# EasyEDA Pro project DA_CNNC.eprj

# Schematic Schematic1
Board Name: 3Pha; Create Date: 2026-03-05; Page Name: P1; Project Name: DA_CNNC; Schematic Name: Schematic1; Update Date: 2026-04-14; Company: EasyEDA.com; Drawn: NV Trieu; Page Size: A4; Version: V1.0
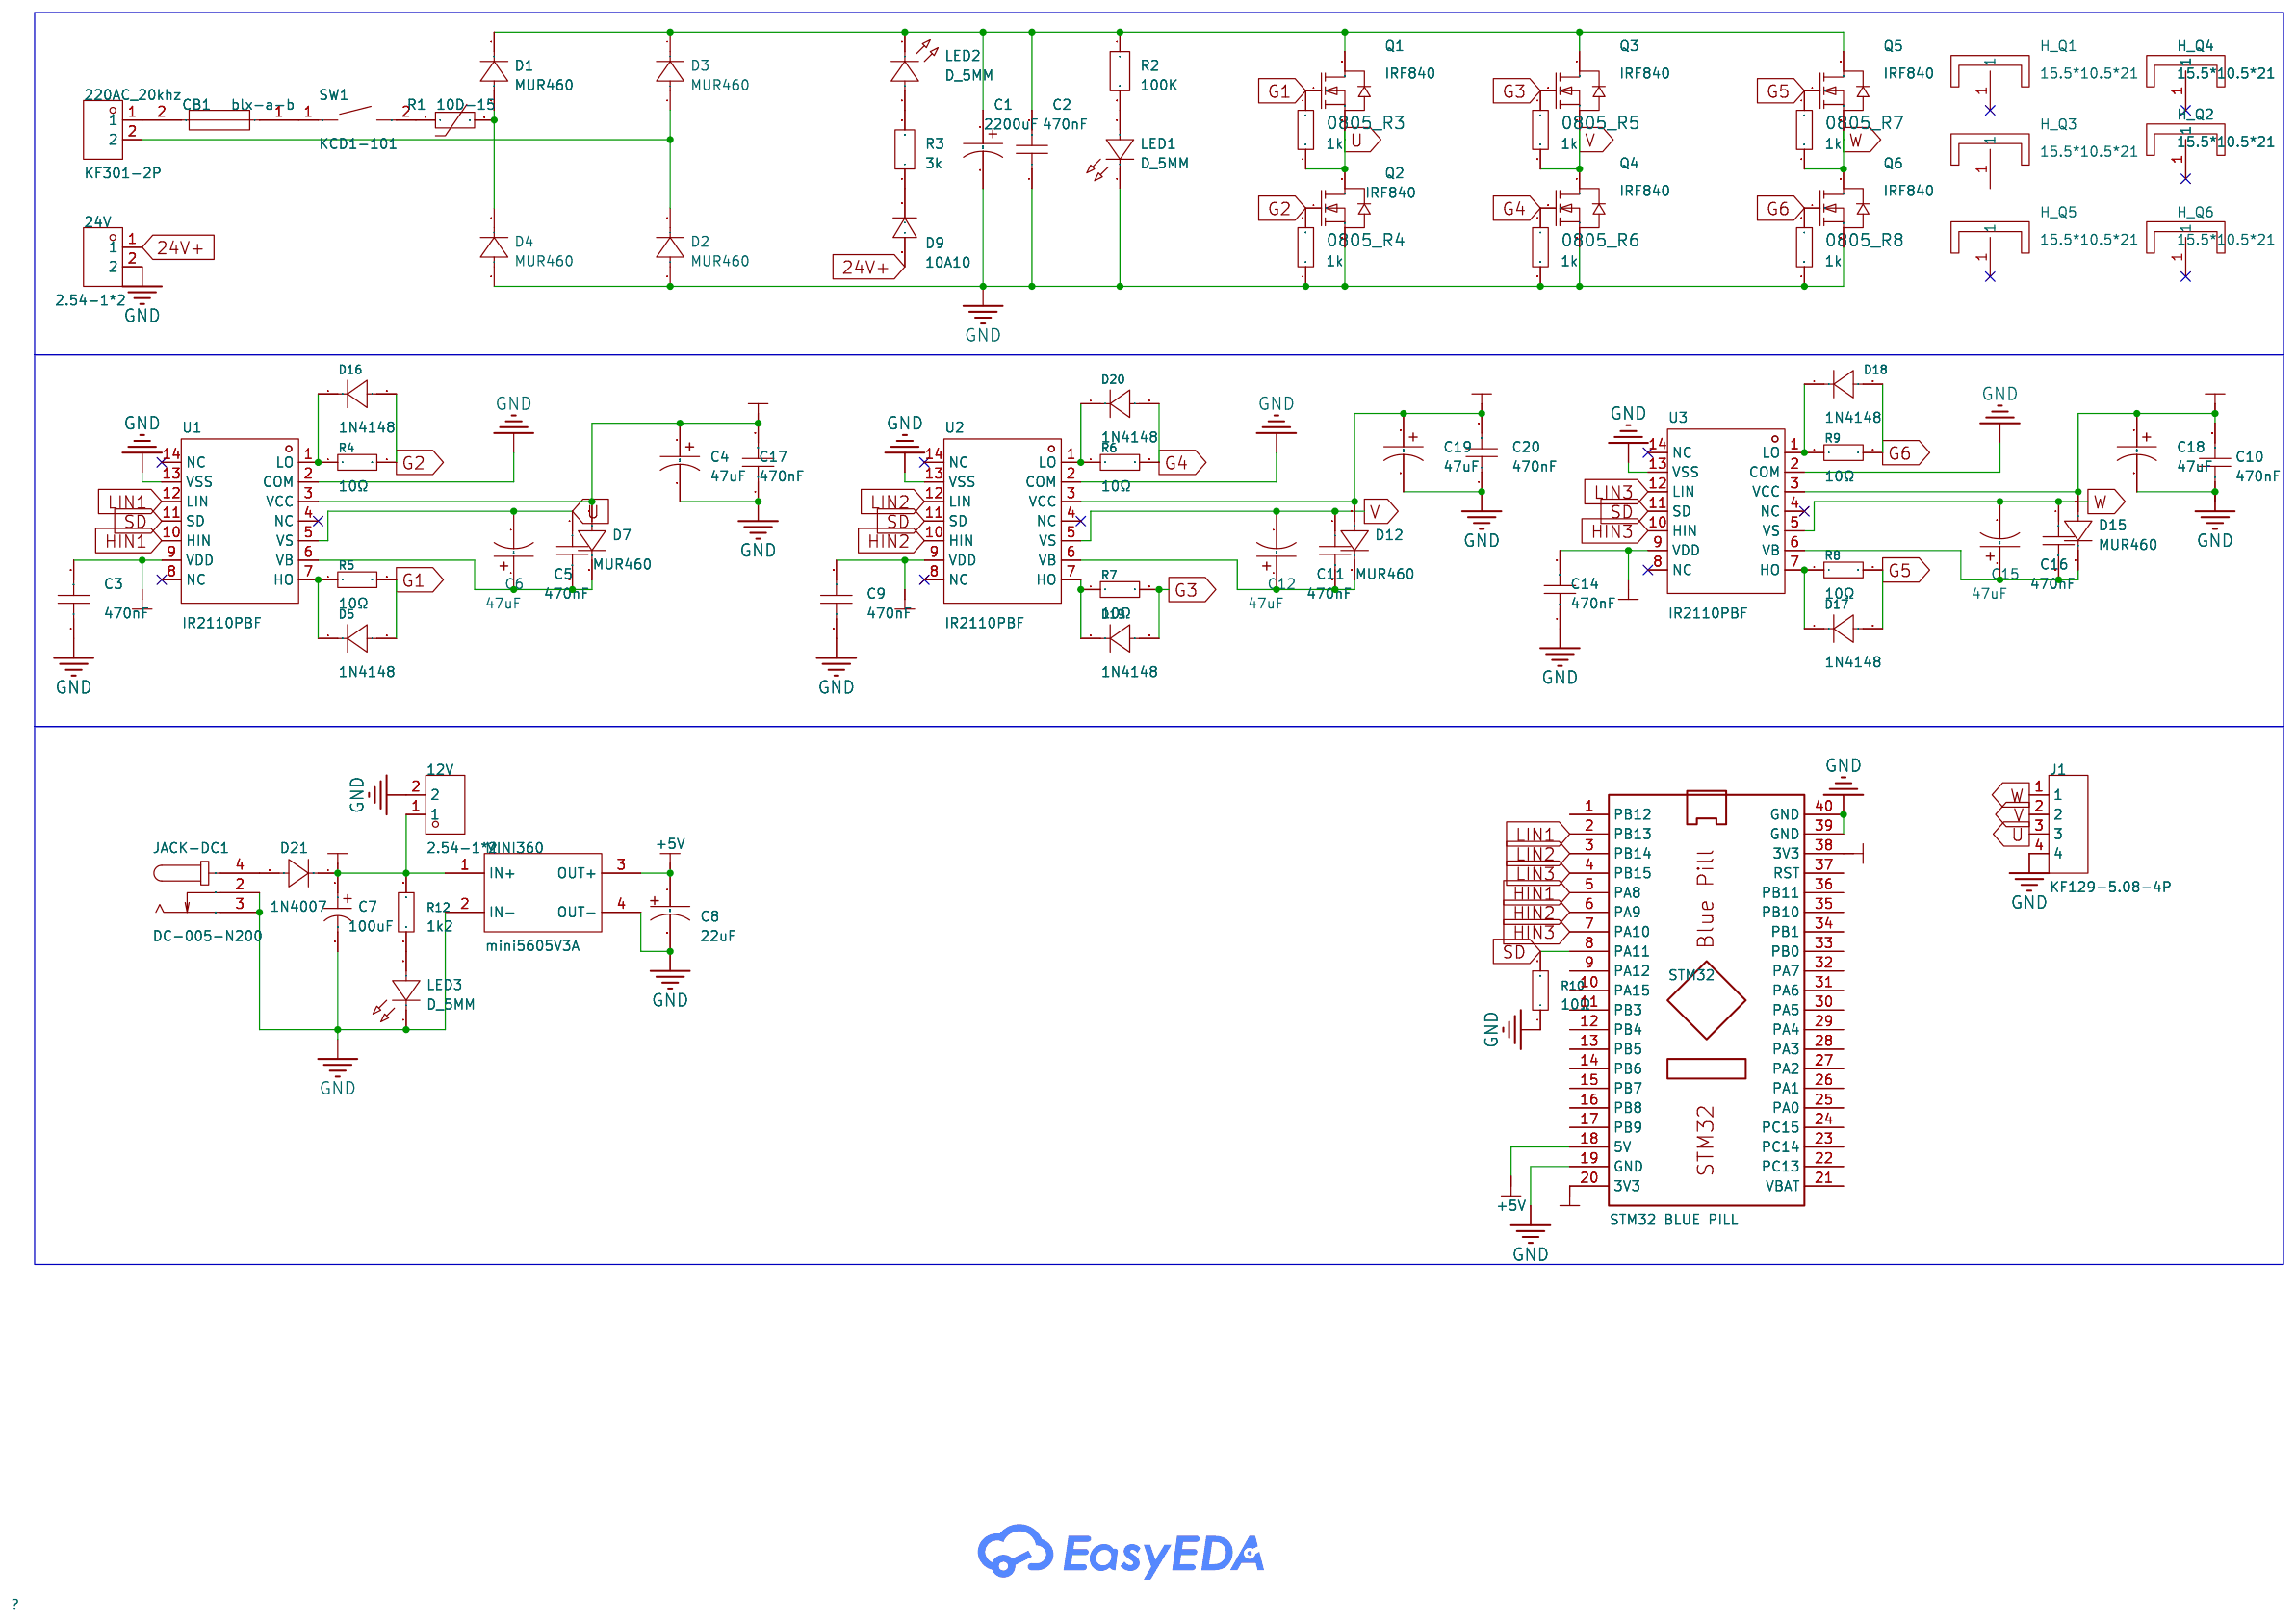
[diagram p0: schematic sheet]

## Parts
12V  2.54-1*2  [HDR-TH_2P-P2.54-V-M]
24V  2.54-1*2  [HDR-TH_2P-P2.54-V-M]
220AC_20khz  KF301-2P  [CONN-TH_XY301V-A-5.0-2P]
0805_R3  1k  [R0805]
0805_R4  1k  [R0805]
0805_R5  1k  [R0805]
0805_R6  1k  [R0805]
0805_R7  1k  [R0805]
0805_R8  1k  [R0805]
C1  2200uF  [CAP-TH_BD25.0-P10.00-D2.3-FD]
C2  470nF  [CAP-TH_L22.5-W7.5-P20.00-D1.2]
C3  470nF  [C0805]
C4  47uF  [CAP-TH_BD6.3-P2.5-D0.5]
C5  470nF  [C0805]
C6  47uF  [CAP-TH_BD6.3-P2.5-D0.5]
C7  100uF  [CAP-TH_BD6.3-P2.50-D0.5-FD-100UF25V6.3X11KM]
C8  22uF  [CAP-TH_BD4.0-P1.50-D0.8-FD]
C9  470nF  [C0805]
C10  470nF  [C0805]
C11  470nF  [C0805]
C12  47uF  [CAP-TH_BD6.3-P2.5-D0.5]
C14  470nF  [C0805]
C15  47uF  [CAP-TH_BD6.3-P2.5-D0.5]
C16  470nF  [C0805]
C17  470nF  [C0805]
C18  47uF  [CAP-TH_BD6.3-P2.5-D0.5]
C19  47uF  [CAP-TH_BD6.3-P2.5-D0.5]
C20  470nF  [C0805]
CB1  blx-a-b  [FUSE-TH_BLX-A-B]
D1  MUR460  [DO-201_BD5.1-L8.4-P15.24-D1.0-RD]
D2  MUR460  [DO-201_BD5.1-L8.4-P15.24-D1.0-RD]
D3  MUR460  [DO-201_BD5.1-L8.4-P15.24-D1.0-RD]
D4  MUR460  [DO-201_BD5.1-L8.4-P15.24-D1.0-RD]
D5  1N4148  [DO-35_BD2.0-L4.2-P8.20-D0.5-RD]
D7  MUR460  [DO-201_BD5.1-L8.4-P15.24-D1.0-RD]
D9  10A10  [R-6_BD8.9-L8.9-P12.90-D1.4-RD]
D12  MUR460  [DO-201_BD5.1-L8.4-P15.24-D1.0-RD]
D15  MUR460  [DO-201_BD5.1-L8.4-P15.24-D1.0-RD]
D16  1N4148  [DO-35_BD2.0-L4.2-P8.20-D0.5-RD]
D17  1N4148  [DO-35_BD2.0-L4.2-P8.20-D0.5-RD]
D18  1N4148  [DO-35_BD2.0-L4.2-P8.20-D0.5-RD]
D19  1N4148  [DO-35_BD2.0-L4.2-P8.20-D0.5-RD]
D20  1N4148  [DO-35_BD2.0-L4.2-P8.20-D0.5-RD]
D21  1N4007  [DO-41_BD2.4-L4.7-P8.70-D0.8-RD]
H_Q1  15.5*10.5*21  [SINK-TH_L15.0-W10.5-H21.0]
H_Q2  15.5*10.5*21  [SINK-TH_L15.0-W10.5-H21.0]
H_Q3  15.5*10.5*21  [SINK-TH_L15.0-W10.5-H21.0]
H_Q4  15.5*10.5*21  [SINK-TH_L15.0-W10.5-H21.0]
H_Q5  15.5*10.5*21  [SINK-TH_L15.0-W10.5-H21.0]
H_Q6  15.5*10.5*21  [SINK-TH_L15.0-W10.5-H21.0]
J1  KF129-5.08-4P  [CONN-TH_4P-P5.08_KF129-5.08-4P]
JACK-DC1  DC-005-N200  [DC-IN-TH_DC-005-N200]
LED1  D_5MM  [LED-TH_BD5.0-P2.54-L-RD_GREEN]
LED2  D_5MM  [LED-TH_BD5.0-P2.54-L-RD_GREEN]
LED3  D_5MM  [LED-TH_BD5.0-P2.54-L-RD_GREEN]
MINI360  mini5605V3A  [COMM-SMD_MINI5605V5A]
Q1  IRF840  [TO-220-3_L10.2-W4.5-P2.54-L-1]
Q2  IRF840  [TO-220-3_L10.2-W4.5-P2.54-L-1]
Q3  IRF840  [TO-220-3_L10.2-W4.5-P2.54-L-1]
Q4  IRF840  [TO-220-3_L10.2-W4.5-P2.54-L-1]
Q5  IRF840  [TO-220-3_L10.2-W4.5-P2.54-L-1]
Q6  IRF840  [TO-220-3_L10.2-W4.5-P2.54-L-1]
R1  10D-15  [RES-TH_L17.5-W6.0-P7.50-D0.8-S7.50]
R2  100K  [RES-TH_L22.0-W10.0-P26.00-D1.0]
R3  3k  [RES-TH_BD2.4-L6.3-P10.30-D0.6]
R4  10Ω  [R1206]
R5  10Ω  [R1206]
R6  10Ω  [R1206]
R7  10Ω  [R1206]
R8  10Ω  [R1206]
R9  10Ω  [R1206]
R10  10Ω  [R1206]
R12  10Ω  [R1206]
STM32  STM32 BLUE PILL  [STM32F103C8T6 BLUE PILL]
SW1  KCD1-101  [SW-TH_KCD1-101]
U1  IR2110PBF  [DIP-14_L20.0-W7.6-P2.54-LS7.6-BL]
U2  IR2110PBF  [DIP-14_L20.0-W7.6-P2.54-LS7.6-BL]
U3  IR2110PBF  [DIP-14_L20.0-W7.6-P2.54-LS7.6-BL]

## Library data of the parts
12V 24V = 2.54-1*2: LCSC Part Name: 停产 1x2P 间距:2.54mm 方针 直插; Supplier Part: C5116481; Manufacturer: ZHOURI(洲日); Supplier Footprint: 插件,P=2.54mm; JLCPCB Part Class: Extended Part; Datasheet: https://item.szlcsc.com/datasheet/2.54-1*2/5692724.html; Supplier: LCSC; Pin Structure: 1x2P; Pitch: 2.54mm; Circluar Pins/Square Pins: Pin Header; Mounting Type: Through Hole; Number of Rows: 1; Number of Pins: 2P; Current Rating: 2.5A; Length of Mating Pin: 6mm; Insulation Height: 2.54mm; Length of End Connection Pin: 3mm; Contact Material: Brass; Contact Plating: Gold; Operating Temperature: -40℃~+105℃
220AC_20khz = KF301-2P接线端子: Supplier Part: C9900016950; Supplier Footprint: CK301-2P; JLCPCB Part Class: Extended Part; Supplier: LCSC; Check: true
0805_R3-0805_R8 = 0805W8F1502T5E: LCSC Part Name: 15kΩ ±1% 125mW 厚膜电阻; Supplier Part: C17475; Manufacturer: UNI-ROYAL(厚声); Supplier Footprint: 0805; JLCPCB Part Class: Basic Part; Datasheet: https://item.szlcsc.com/datasheet/0805W8F1502T5E/18163.html; Supplier: LCSC; Type: Thick Film Resistor; Tolerance: ±1%; Power(Watts): 125mW; Voltage-Supply(Max): 150V; Temperature Coefficient: ±100ppm/℃; Operating Temperature: -55℃~+155℃
C1 = 450VXG220MEFCSN25X40: LCSC Part Name: 220uF ±20% 450V; Supplier Part: C1608988; Manufacturer: Rubycon(红宝石); Supplier Footprint: 插件,D25xL40mm; JLCPCB Part Class: Extended Part; Supplier: LCSC; Tolerance: ±20%; Voltage Rating: 450V; Pin Spacing: 10mm; Ripple Current: 1.96A@10kHz; Diameter: 25mm; Height - Seated (Max): 40mm; Lifetime: 5000hrs@105℃; Operating Temperature: -40℃~+150℃
C2 = KP474J2J2001: LCSC Part Name: 470nF ±5% 630V; Supplier Part: C390154; Manufacturer: KYET(科雅); Supplier Footprint: 插件,P=20mm; JLCPCB Part Class: Extended Part; Datasheet: https://item.szlcsc.com/datasheet/KP474J2J2001/366187.html; Supplier: LCSC; Tolerance: ±5%; Voltage Rating: 630V; Operating Temperature: -40℃~+100℃
C3 C5 C9-C11 C14 C16 C17 C20 = CC0805CRNPO0BN4R7: LCSC Part Name: ±0.25pF 4.7pF 100V; Supplier Part: C527074; Manufacturer: YAGEO(国巨); Supplier Footprint: 0805; JLCPCB Part Class: Extended Part; Datasheet: https://item.szlcsc.com/datasheet/CC0805CRNPO0BN4R7/545500.html; Supplier: LCSC; Voltage Rating: 100V; Temperature Coefficient: NP0
C4 C6 C12 C15 C18 C19 = 50V47uF CD288: LCSC Part Name: 47uF ±20% 50V; Supplier Part: C2960223; Manufacturer: HRK(鸿瑞凯电子); Supplier Footprint: 插件,D6.3xL12mm; JLCPCB Part Class: Extended Part; Supplier: LCSC; Tolerance: ±20%; Voltage Rating: 50V; Pin Spacing: 2.5mm; Diameter: 6.3mm; Height - Seated (Max): 12mm; Operating Temperature: -40℃~+105℃
C7 = 100uF25V6.3x11KM: Capacitance:100uF Tolerance:±20% Tolerance:±20% Voltage Rating:25V Ripple Current:159mA@120Hz Pin Spacing:2.5mm Diameter:6.3mm Height - Seated (Max):11mm Lifetime:2000hrs@105℃ Operating Temperature:-40℃~+105℃ Operating Temperature:-40℃~+105℃; LCSC Part Name: 100uF ±20% 25V; Supplier Part: C49304911; Manufacturer: Econd(米朗电子); Supplier Footprint: 插件,D6.3xL11mm; JLCPCB Part Class: Extended Part; Datasheet: https://item.szlcsc.com/datasheet/100uF25V6.3x11KM/51766739.html; Supplier: LCSC; Tolerance: ±20%; Voltage Rating: 25V; Ripple Current: 159mA@120Hz; Pin Spacing: 2.5mm; Diameter: 6.3mm; Height - Seated (Max): 11mm; Lifetime: 2000hrs@105℃; Operating Temperature: -40℃~+105℃
C8 = ECEA1CKA220: Capacitance: Tolerance:±20% Tolerance:±20% Rated Voltage: Lead Spacing: φD: L: Lifetime @ Temp:1000hrs@85℃; LCSC Part Name: 22uF ±20% 16V; Supplier Part: C278384; Manufacturer: PANASONIC(松下); Supplier Footprint: 插件,D4xL7mm; JLCPCB Part Class: Extended Part; Datasheet: https://atta.szlcsc.com/upload/public/pdf/source/20181114/C278384_A81005466B9281EB1716D75F86A016AD.pdf; Supplier: LCSC; Tolerance: ±20%; Lifetime @ Temp: 1000hrs@85℃
CB1 = BLX-A-B: Voltage Rating:500V Current Rating:10A; Supplier Part: C41371862; Manufacturer: XFCN(兴飞); Supplier Footprint: 插件,P=22.3mm; JLCPCB Part Class: Extended Part; Datasheet: https://atta.szlcsc.com/upload/public/pdf/source/20240828/99BD40486647FE73831CA601C884103B.pdf; Supplier: LCSC; Voltage Rating: 500V; Current Rating: 10A
D1-D4 D7 D12 D15 = MUR460_C2990844: Supplier Part: C2990844; Manufacturer: GOOD-ARK(固锝); Supplier Footprint: DO-201AD; JLCPCB Part Class: Extended Part; Datasheet: https://item.szlcsc.com/datasheet/MUR460/3451423.html; Supplier: LCSC; Voltage - Forward(Vf@If): 1.28V@4A; Voltage - DC Reverse(Vr): 600V; Current - Rectified: 4A; Reverse Leakage Current (Ir): 10uA@600V; Reverse Recovery Time (trr): 50ns; Operating Junction Temperature Range: -55℃~+175℃@(Tj)
D5 D16-D20 = 1N4148_C493188: Supplier Part: C493188; Manufacturer: SMC(桑德斯); Supplier Footprint: DO-35; JLCPCB Part Class: Extended Part; Datasheet: https://item.szlcsc.com/datasheet/1N4148/503800.html; Supplier: LCSC; Diode Configuration: Independent; Voltage - Forward(Vf@If): 1V@10mA; Voltage - DC Reverse(Vr): 75V; Current - Rectified: 150mA; Reverse Leakage Current (Ir): 5uA@75V; Reverse Recovery Time (trr): 4ns; Operating Junction Temperature Range: -65℃~+175℃@(Tj); Non-Repetitive Peak Forward Surge Current: 2A
D9 = 10A10: Diode Configuration: Forward Voltage (Vf@If):- Reverse Voltage (Vr):- Average Rectified Current (Io):- Reverse Leakage Current:-; Supplier Part: C132146; Supplier Footprint: R-6; JLCPCB Part Class: Extended Part; Supplier: LCSC
D21 = 1N4007_C47018538: LCSC Part Name: 1kV 1A; Supplier Part: C47018538; Manufacturer: baocheng(宝乘); Supplier Footprint: DO-41; JLCPCB Part Class: Extended Part; Datasheet: https://item.szlcsc.com/datasheet/1N4007/49200033.html; Supplier: LCSC; Diode Configuration: 1 Independent; Voltage - Forward(Vf@If): 1V@1A; Voltage - DC Reverse(Vr): 1kV; Current - Rectified: 1A; Reverse Leakage Current (Ir): 5uA@50V; Non-Repetitive Peak Forward Surge Current: 30A; Operating Junction Temperature Range: -55℃~+150℃
H_Q1-H_Q6 = 15.5*10.5*21: LCSC Part Name: XSD(鑫顺达)to-220 to-247二极管铝型材散热片 15.5*10.5*21 本色带针大功率电子散热器（可定制）; Supplier Part: C4649; Manufacturer: XSD(鑫顺达); JLCPCB Part Class: Extended Part; Datasheet: https://item.szlcsc.com/datasheet/15.5*10.5*21/5057.html; Supplier: LCSC; ProductSize: 15.5*10.5*21MM; Colour: White; TextureOfMaterial: 6063-T5; SurfaceTreatment: Natural Color Washed White; Shape: H-Type
J1 = KF129-5.08-4P: Supplier Part: C9900018789; JLCPCB Part Class: Extended Part; Supplier: LCSC
JACK-DC1 = DC-005-N200: Supplier Part: C49566362; Manufacturer: HANBO(汉博); Supplier Footprint: 插件; JLCPCB Part Class: Extended Part; Datasheet: https://item.szlcsc.com/datasheet/DC-005-N200/52120587.html; Supplier: LCSC
LED1-LED3 = 草帽LED绿灯: Supplier Part: C9900023560; Supplier Footprint: LED_5MM; JLCPCB Part Class: Extended Part; Supplier: LCSC
MINI360 = mini5605V5A输出电源模块: Supplier Part: C9900015474; Supplier Footprint: SMD; JLCPCB Part Class: Extended Part; Supplier: LCSC
Q1-Q6 = IRF840_C2980294: LCSC Part Name: N沟道,电流:8A,耐压:500V; Supplier Part: C2980294; Manufacturer: minos(迈诺斯); Supplier Footprint: TO-220; JLCPCB Part Class: Extended Part; Datasheet: https://item.szlcsc.com/datasheet/IRF840/3401452.html; Supplier: LCSC; Number: 1 N-Channel; Drain to Source Voltage: 500V; Current - Continuous Drain(Id): 8A; RDS(on): 730mΩ@10V; Pd - Power Dissipation: 134W; Gate Threshold Voltage (Vgs(th)): 3V@250uA; Gate Charge(Qg): 25nC@10V; Input Capacitance(Ciss): 1.57nF; Reverse Transfer Capacitance (Crss@Vds): 20pF; Type: N-Channel; Output Capacitance(Coss): 195pF
R1 = 10D-15: LCSC Part Name: 10Ω 2950K MF72功率型热敏电阻; Supplier Part: C2839621; Manufacturer: SURGING(绍鑫); Supplier Footprint: 插件,P=7.5mm; JLCPCB Part Class: Extended Part; Datasheet: https://item.szlcsc.com/datasheet/10D-15/3016804.html; Supplier: LCSC; Resistance @ 25℃: 10Ω; B Constant (25℃/50℃): 2950K; Steady State Current (Max): 5A; Operating Temperature: -40℃~+200℃; Dissipation Factor: 18mW/℃; Thermal Time Constant: 49.17min; Pitch: 7.5mm
R2 = SQP5W-3Ω±5%-9P: LCSC Part Name: 水泥电阻 3Ω ±5% 5W; Supplier Part: C5808017; Manufacturer: VO(翔胜); Supplier Footprint: 插件,D10xL22mm; JLCPCB Part Class: Extended Part; Datasheet: https://item.szlcsc.com/datasheet/SQP5W-3%25CE%25A9%25C2%25B15%2525-9P/6737266.html; Supplier: LCSC; Type: Cement Resistor; Tolerance: ±5%; Voltage-Supply(Max): 500V; Power(Watts): 5W; Operating Temperature: -55℃~+155℃
R3 = RD 1/4W 220R J T/B A1: LCSC Part Name: 220Ω ±5% 250mW 碳膜电阻; Supplier Part: C433749; Manufacturer: Tyohm(幸亚电阻); Supplier Footprint: 插件,D2.4xL6.5mm; JLCPCB Part Class: Extended Part; Datasheet: https://item.szlcsc.com/datasheet/RD%25201%252F4W%2520220R%2520J%2520T%252FB%2520A1/430754.html; Supplier: LCSC; Type: Carbon Film Resistor; Tolerance: ±5%; Power(Watts): 250mW; Temperature Coefficient: 0ppm/℃~+500ppm/℃
R4-R10 R12 = 1206W4F100KT5E: LCSC Part Name: 1Ω ±1% 250mW 厚膜电阻; Supplier Part: C17928; Manufacturer: UNI-ROYAL(厚声); Supplier Footprint: 1206; JLCPCB Part Class: Basic Part; Datasheet: https://item.szlcsc.com/datasheet/1206W4F100KT5E/18616.html; Supplier: LCSC; Type: Thick Film Resistor; Tolerance: ±1%; Power(Watts): 250mW; Voltage-Supply(Max): 200V; Temperature Coefficient: ±200ppm/℃; Operating Temperature: -55℃~+155℃
STM32 = STM32 BLUE PILL
SW1 = KCD1-101: Supplier Part: C9900022451; Supplier Footprint: Throughhole; JLCPCB Part Class: Extended Part; Supplier: LCSC
U1-U3 = IR2110PBF: LCSC Part Name: 高端和低端驱动器; Supplier Part: C2967; Manufacturer: Infineon(英飞凌); Supplier Footprint: DIP-14; JLCPCB Part Class: Extended Part; Datasheet: https://item.szlcsc.com/datasheet/IR2110PBF/3349.html; Supplier: LCSC; Driven Configuration: Half-Bridge; Load Type: IGBT；MOSFET; Number of Drivers: 2; Current - Output Low(IOL): 2A; Current - Output High(IOH): 2A; Voltage - Supply: 10V~20V; Rise Time: 110ns; Fall Time: 25ns; Propagation Delay tpLH: 120ns; Propagation Delay tpHL: 94ns; Features: Under Voltage Protection; Operating Temperature: -40℃~+150℃; Quiescent Current(Iq): 15uA

## Nets
24V+: 24V.1 D9.2(A)
+3.3V: C3.2 C9.2 C14.2 STM32.20(3V3) STM32.38(3V3) U1.9(VDD) U2.9(VDD) U3.9(VDD)
+5V: C8.1 MINI360.3(OUT+) STM32.18(5V)
+12V: 12V.1 C4.1 C7.1 C10.2 C17.2 C18.1 C19.1 C20.2 D7.2(A) D12.2(A) D15.2(A) D21.1(C) MINI360.1(IN+) R12.2 U1.3(VCC) U2.3(VCC) U3.3(VCC)
GND: 12V.2 24V.2 0805_R4.1 0805_R6.2 0805_R8.2 C1.2 C2.1 C3.1 C4.2 C7.2 C8.2 C9.1 C10.1 C14.1 C17.1 C18.2 C19.2 C20.1 D2.2(A) D4.2(A) J1.4 JACK-DC1.2 JACK-DC1.3 LED1.1(K) LED3.1(K) MINI360.2(IN-) MINI360.4(OUT-) Q2.3(S) Q4.3(S) Q6.3(S) R10.1 STM32.19(GND) STM32.39(GND) STM32.40(GND) U1.2(COM) U1.13(VSS) U2.2(COM) U2.13(VSS) U3.2(COM) U3.13(VSS)
G1: 0805_R3.1 D5.2(A) Q1.1(G) R5.2
G2: 0805_R4.2 D16.2(A) Q2.1(G) R4.2
G3: 0805_R5.1 D19.2(A) Q3.1(G) R7.2
G4: 0805_R6.1 D20.2(A) Q4.1(G) R6.2
G5: 0805_R7.1 D17.2(A) Q5.1(G) R8.2
G6: 0805_R8.1 D18.2(A) Q6.1(G) R9.2
HIN1: STM32.5(PA8) U1.10(HIN)
HIN2: STM32.6(PA9) U2.10(HIN)
HIN3: STM32.7(PA10) U3.10(HIN)
LIN1: STM32.2(PB13) U1.12(LIN)
LIN2: STM32.3(PB14) U2.12(LIN)
LIN3: STM32.4(PB15) U3.12(LIN)
SD: R10.2 STM32.8(PA11) U1.11(SD) U2.11(SD) U3.11(SD)
U: 0805_R3.2 C5.1 C6.2 J1.3 Q1.3(S) Q2.2(D) U1.5(VS)
V: 0805_R5.2 C11.1 C12.2 J1.2 Q3.3(S) Q4.2(D) U2.5(VS)
W: 0805_R7.2 C15.2 C16.1 J1.1 Q5.3(S) Q6.2(D) U3.5(VS)
$1N1189: D1.2(A) D4.1(K) R1.2
$1N1193: C1.1 C2.2 D1.1(K) D3.1(K) LED2.1(K) Q1.2(D) Q3.2(D) Q5.2(D) R2.1
$1N1203: 220AC_20khz.2 D2.1(K) D3.2(A)
$1N1451: 220AC_20khz.1 CB1.2
$1N1570: CB1.1 SW1.1
$1N1572: R1.1 SW1.2
$1N2568: LED1.2(A) R2.2
$1N4239: D5.1(K) R5.1 U1.7(HO)
$1N4372: D16.1(K) R4.1 U1.1(LO)
$1N7045: C5.2 C6.1 D7.1(K) U1.6(VB)
$1N7570: D19.1(K) R7.1 U2.7(HO)
$1N7573: D20.1(K) R6.1 U2.1(LO)
$1N7591: C11.2 C12.1 D12.1(K) U2.6(VB)
$1N8447: D17.1(K) R8.1 U3.7(HO)
$1N8450: D18.1(K) R9.1 U3.1(LO)
$1N8468: C15.1 C16.2 D15.1(K) U3.6(VB)
$1N24434: D21.2(A) JACK-DC1.4
$1N24781: D9.1(K) R3.1
$1N24783: LED2.2(A) R3.2
$1N34091: LED3.2(A) R12.1

Not connected (* = marked no-connect by the designer): H_Q1 1*; H_Q2 1*; H_Q3 1; H_Q4 1*; H_Q5 1*; H_Q6 1*; STM32 1(PB12) 9(PA12) 10(PA15) 11(PB3) 12(PB4) 13(PB5) 14(PB6) 15(PB7) 16(PB8) 17(PB9) 21(VBAT) 22(PC13) 23(PC14) 24(PC15) 25(PA0) 26(PA1) 27(PA2) 28(PA3) 29(PA4) 30(PA5) 31(PA6) 32(PA7) 33(PB0) 34(PB1) 35(PB10) 36(PB11) 37(RST); U1 4(NC)* 8(NC)* 14(NC)*; U2 4(NC)* 8(NC)* 14(NC)*; U3 4(NC)* 8(NC)* 14(NC)*

# Board PCB1
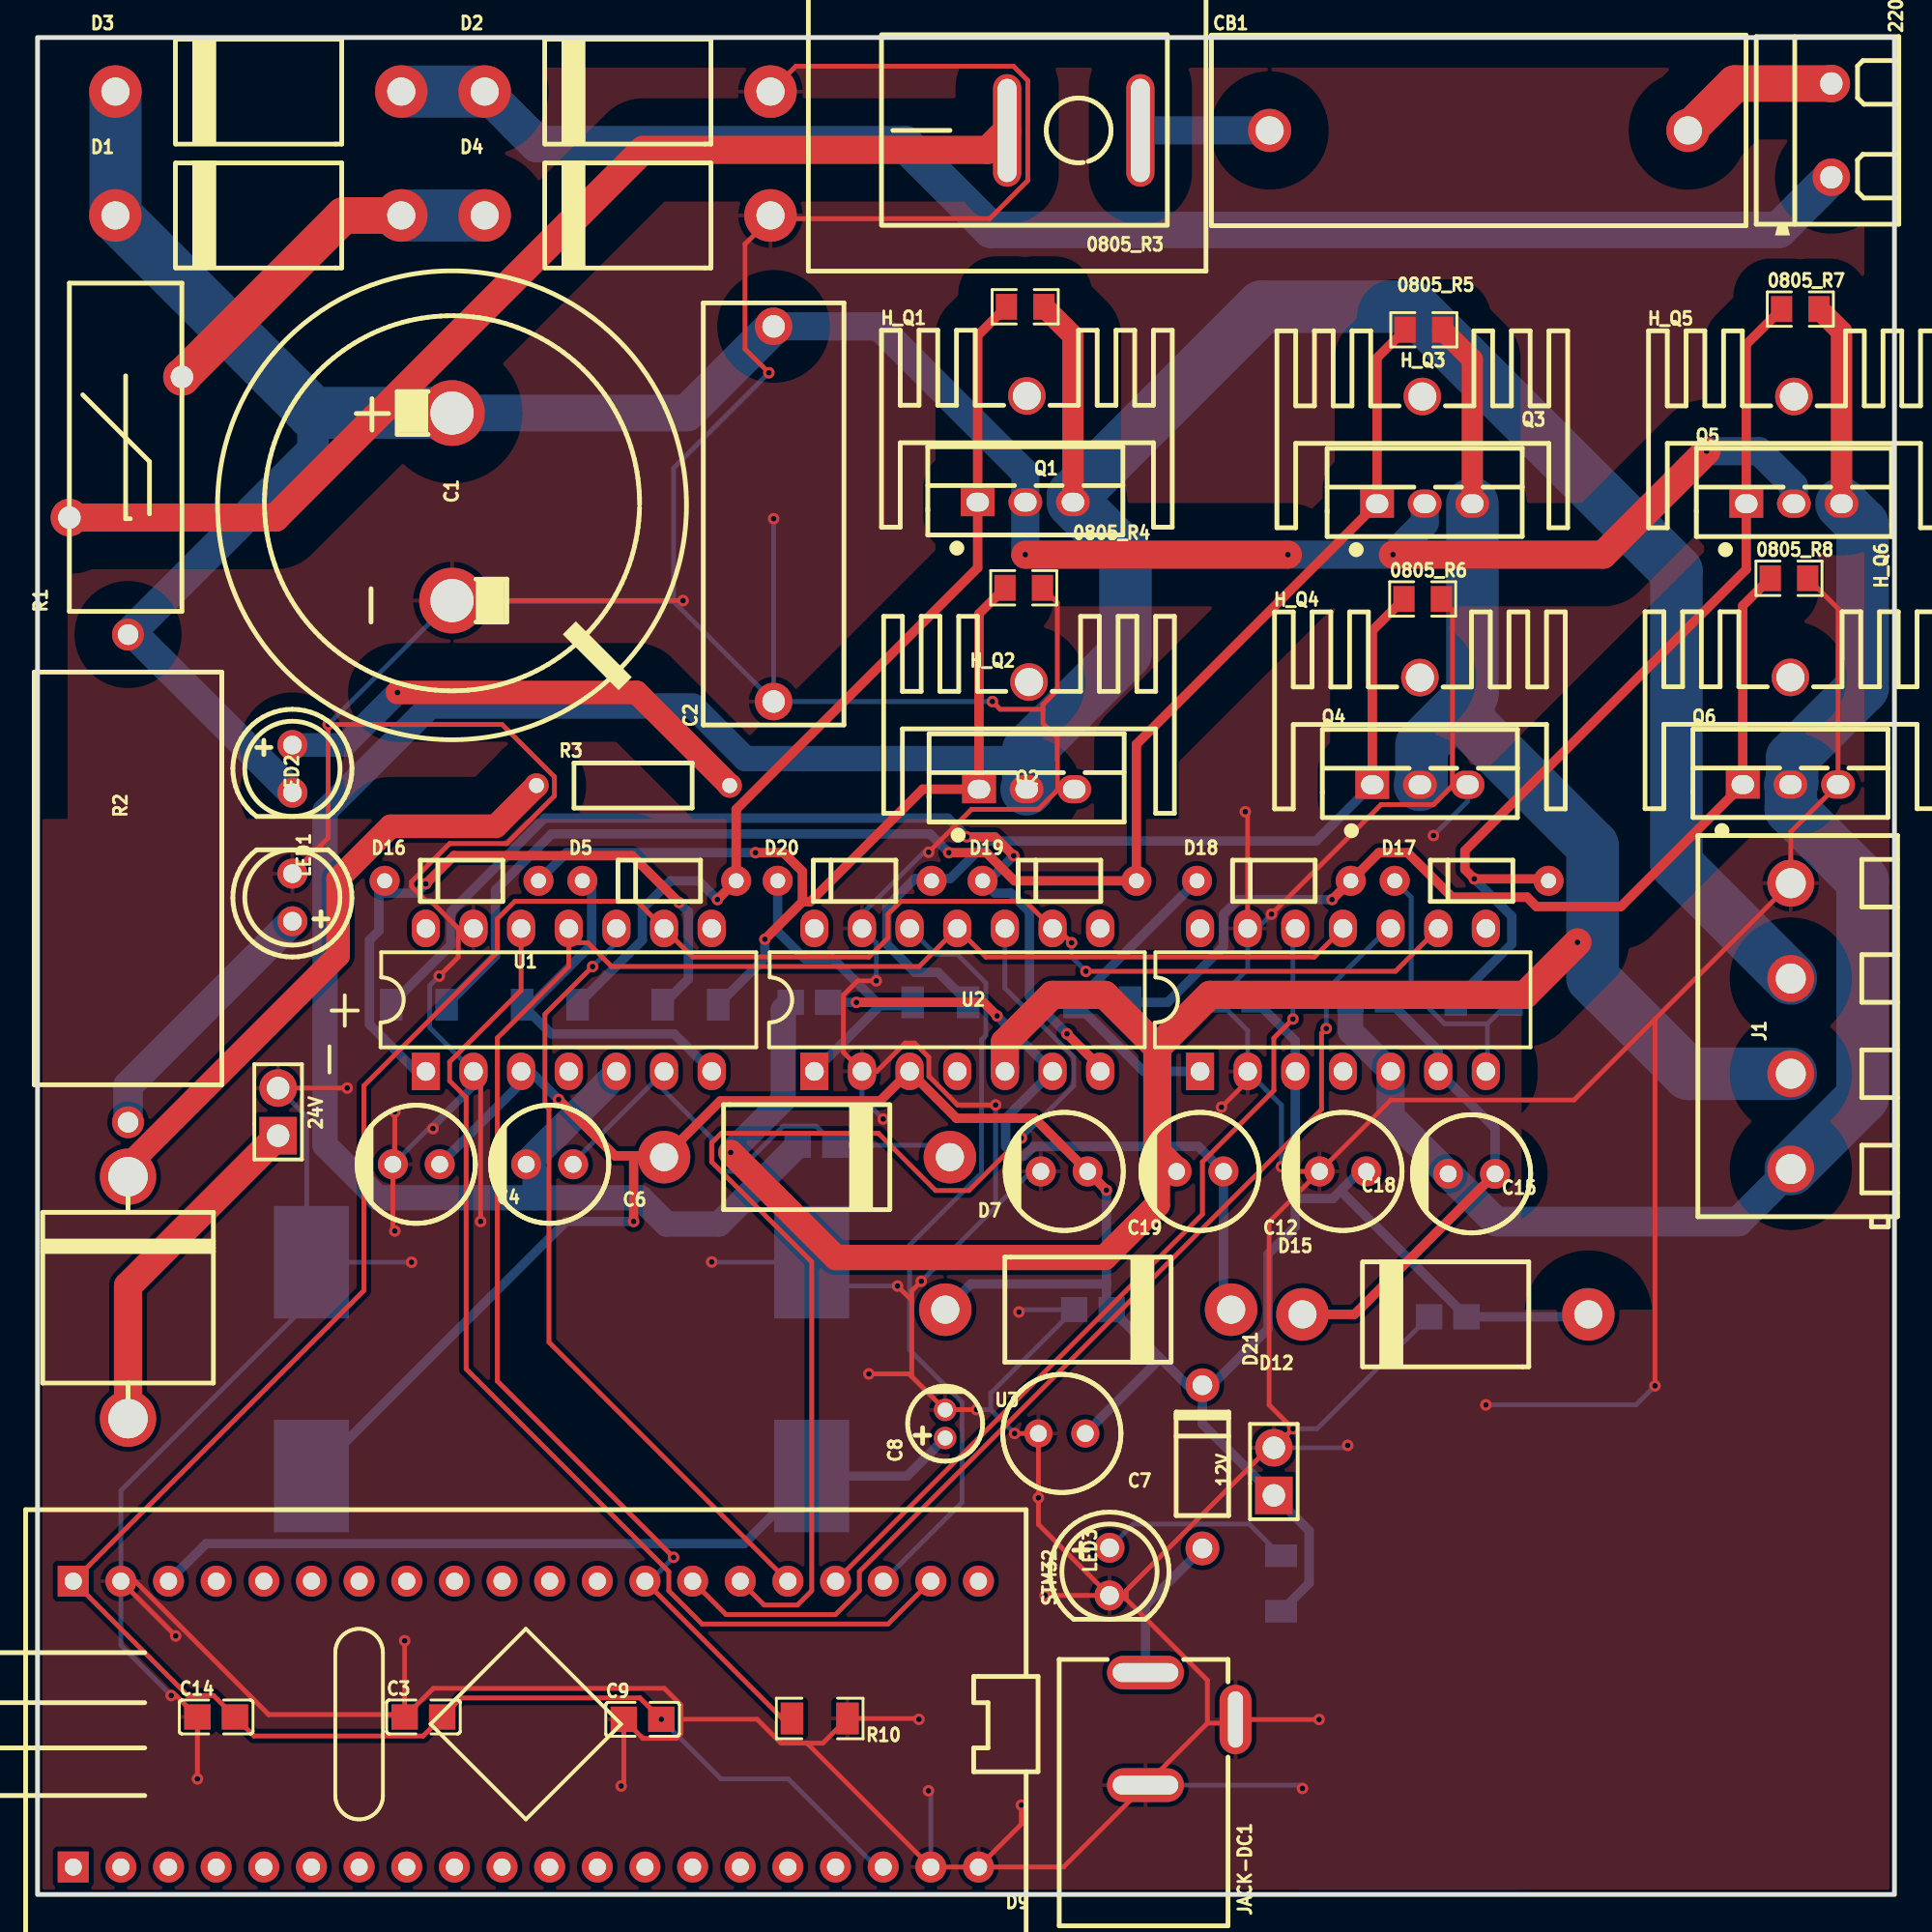
[diagram p1: board, top side]
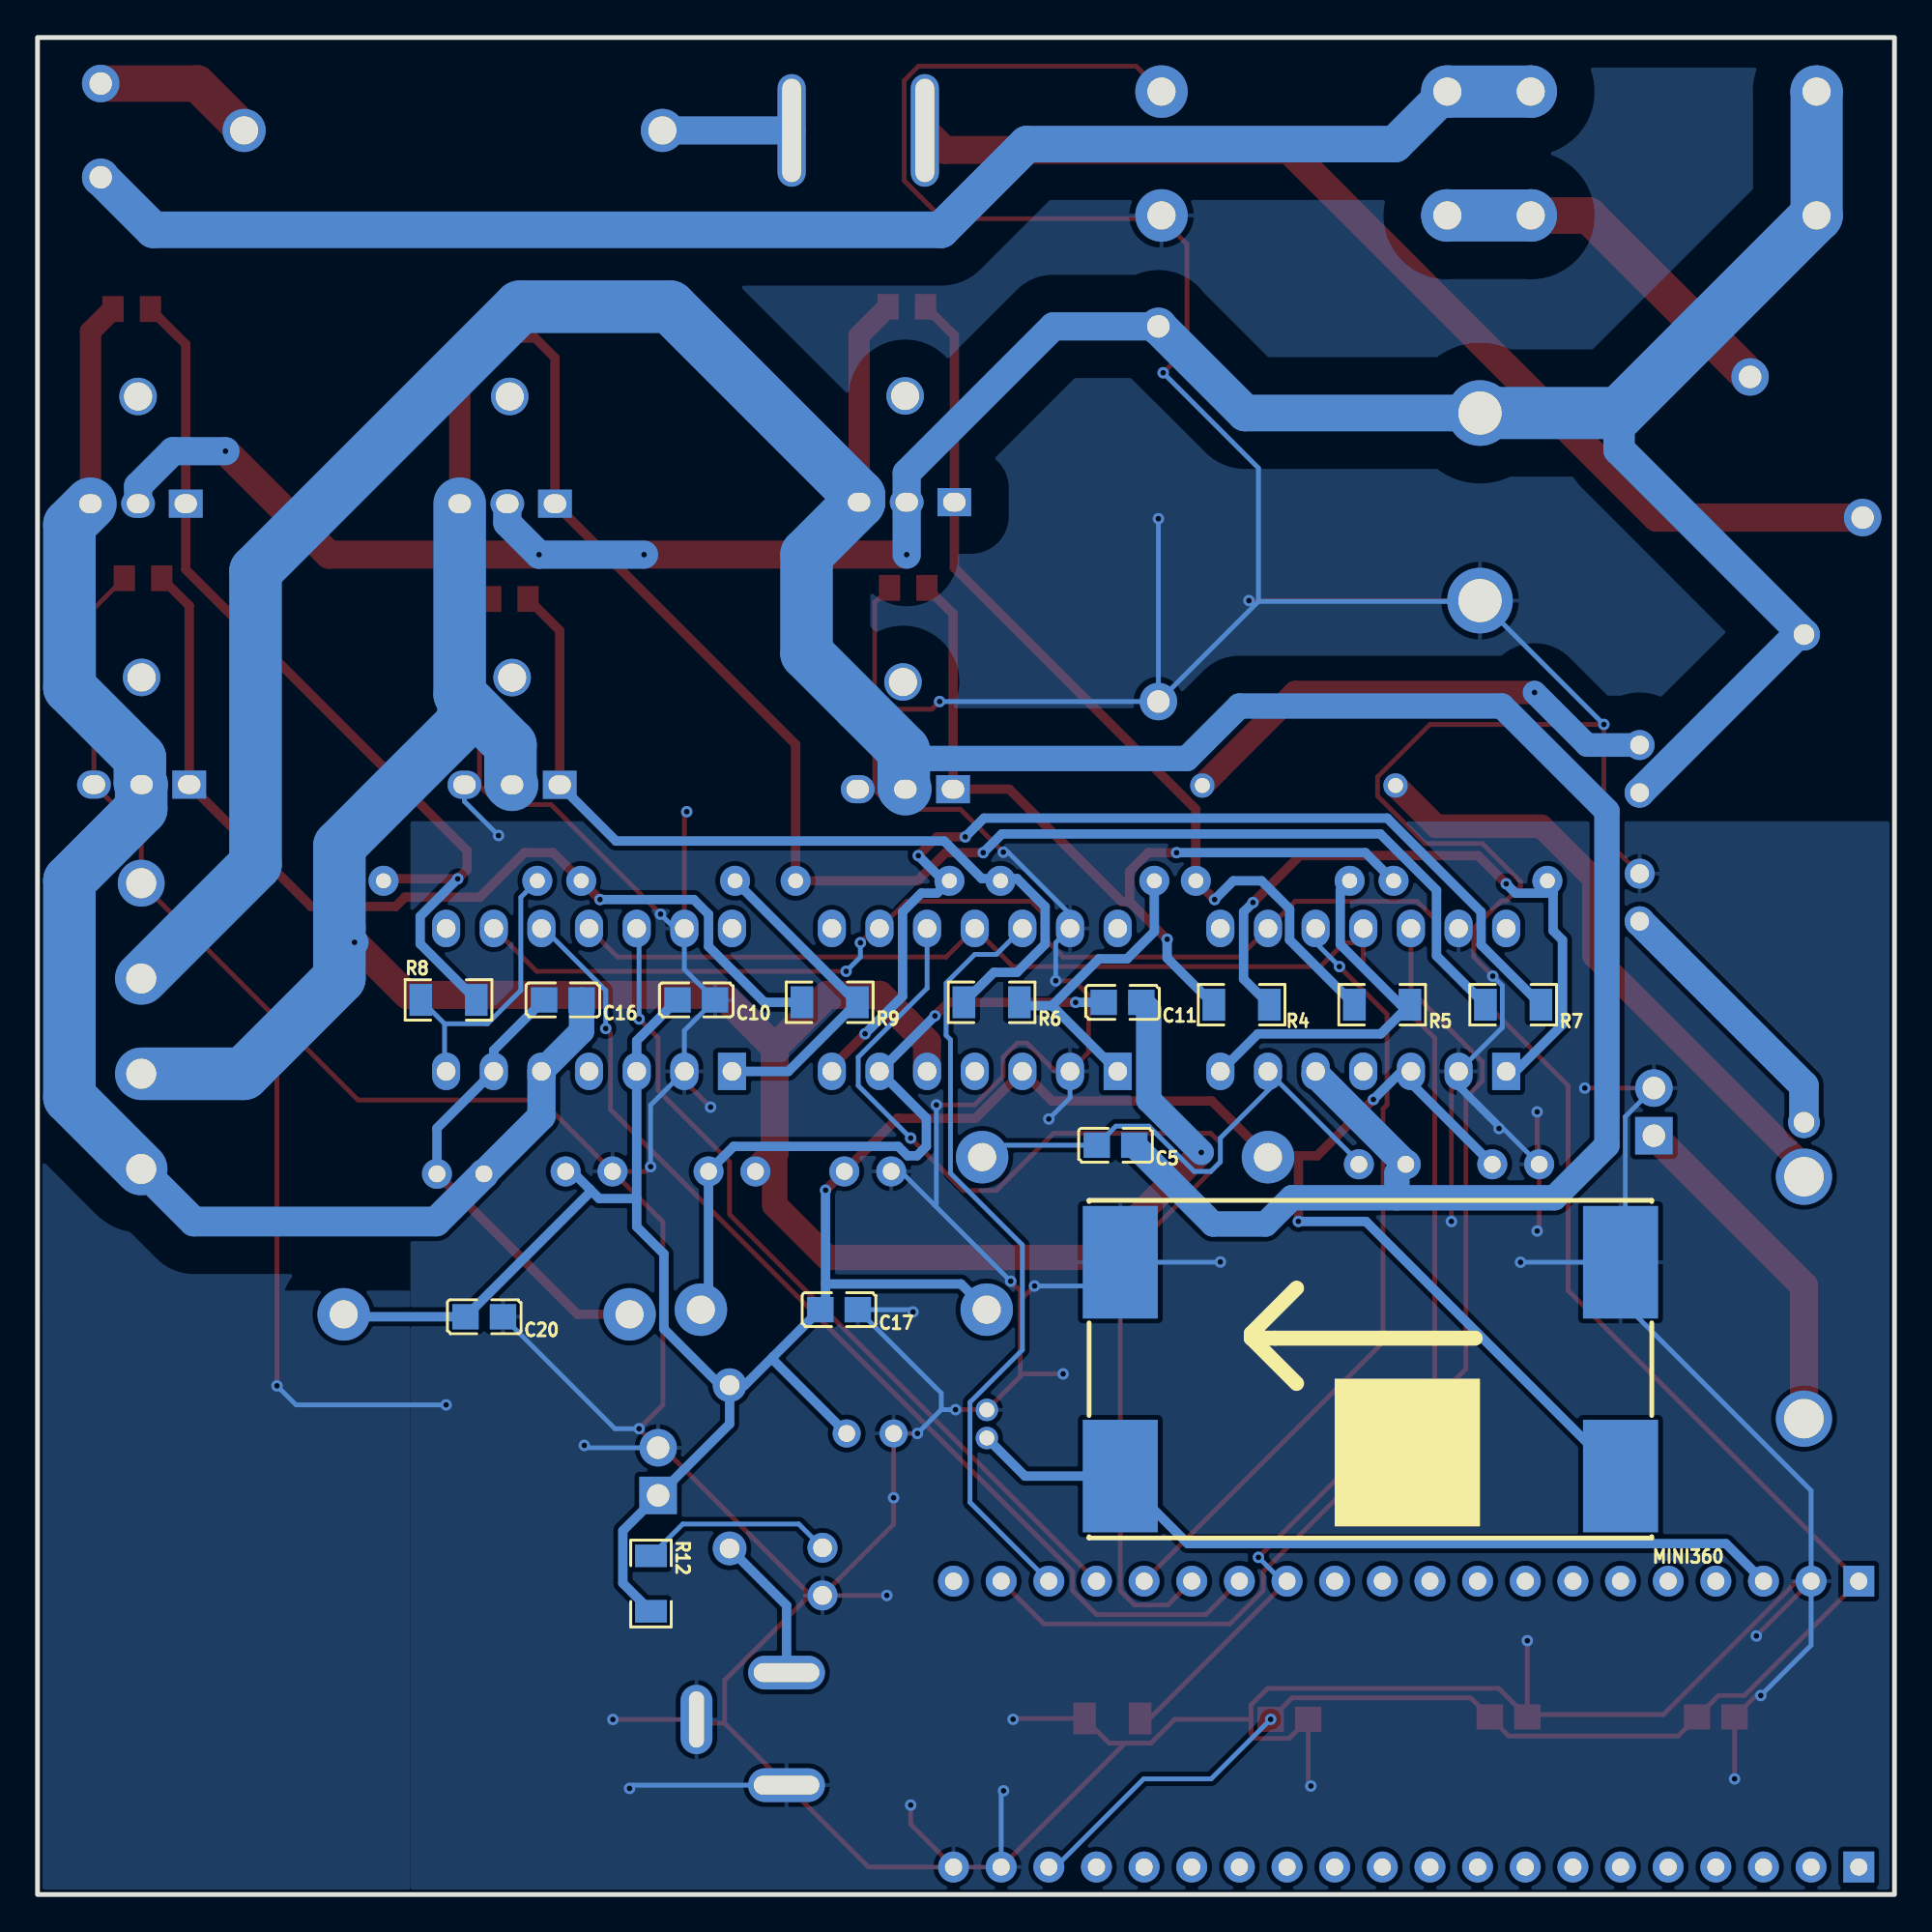
[diagram p2: board, bottom side, seen from below]

Outline 99 x 99 mm; copper layers: Top Layer, Bottom Layer. Coordinates in mm from the lower left corner of the outline.
Outline path: rectangle 0,99 99,0
Stack: Top Layer 0.035mm / Dielectric1 1.51mm FR4 er 4.5 / Bottom Layer 0.035mm

## Design rules (mm)
template: Custom Config
spacing copperThickness1oz (default): track to track 0.102, other pairs 0.152 to 0.3
spacing copperThickness2oz: track to track 0.203, other pairs 0.152 to 0.3
track width copperThickness1oz (default): min 0.127, default 0.254, max 2.54
track width copperThickness2oz: min 0.203, default 0.254, max 2.54
track width 311-220V: min 0.127, default 2.8, max 4
track width G_Mos: min 0.127, default 0.5, max 2.54
track width 12V: min 0.127, default 0.5, max 2.54
track width GND: min 0.127, default 0.254, max 99
differential pair differentialPair (default): width min 0.127, default 0.254, max 2.54; gap min 0.152, default 0.152
via viaSize (default): diameter min 0.5, default 0.61, max 10; hole min 0.3, default 0.305, max 6.3
net $1N1189 uses 311-220V
net $1N1203 uses 311-220V
net $1N1193 uses 311-220V
net $1N1451 uses 311-220V
net $1N1570 uses 311-220V
net U uses 311-220V
net V uses 311-220V
net W uses 311-220V
net $1N1572 uses 311-220V
net $1N2568 uses 311-220V
net GND uses CCCCC, GND
net +5V uses 12V
net G1 uses G_Mos
net G2 uses G_Mos
net G3 uses G_Mos
net G4 uses G_Mos
net G5 uses G_Mos
net G6 uses G_Mos
net $1N4239 uses 12V
net +12V uses 12V
net $1N4372 uses 12V
net $1N7570 uses 12V
net $1N7573 uses 12V
net $1N7591 uses 12V
net $1N8468 uses 12V
net $1N8450 uses 12V
net $1N24434 uses 12V
net 24V+ uses 311-220V
net $1N24781 uses 311-220V
net $1N24783 uses 311-220V
pour e15449 uses copperRegion
pour e15475 uses copperRegion
pour e15537 uses CCCCC
pour e15683 uses CCCCC
pour e15807 uses CCCCC
pour e15934 uses CCCCC

## Placement (name value [footprint] x y rotation side)
12V  2.54-1*2  [HDR-TH_2P-P2.54-V-M]  65.91 22.55 90 top
24V  2.54-1*2  [HDR-TH_2P-P2.54-V-M]  12.83 41.72 90 top
220AC_20khz  KF301-2P  [CONN-TH_XY301V-A-5.0-2P]  95.63 94.05 270 top
0805_R3  1k  [R0805]  52.66 84.64 0 top
0805_R4  1k  [R0805]  52.58 69.66 180 top
0805_R5  1k  [R0805]  73.91 83.42 0 top
0805_R6  1k  [R0805]  73.85 69.07 0 top
0805_R7  1k  [R0805]  93.98 84.52 0 top
0805_R8  1k  [R0805]  93.38 70.17 0 top
C1  2200uF  [CAP-TH_BD25.0-P10.00-D2.3-FD]  22.1 73.98 270 top
C2  470nF  [CAP-TH_L22.5-W7.5-P20.00-D1.2]  39.24 73.6 90 top
C3  470nF  [C0805]  20.57 9.47 0 top
C4  47uF  [CAP-TH_BD6.3-P2.5-D0.5]  20.19 38.93 180 top
C5  470nF  [C0805]  41.53 39.94 0 bottom
C6  47uF  [CAP-TH_BD6.3-P2.5-D0.5]  27.31 38.93 180 top
C7  100uF  [CAP-TH_BD6.3-P2.50-D0.5-FD-100UF25V6.3X11KM]  54.61 24.58 180 top
C8  22uF  [CAP-TH_BD4.0-P1.50-D0.8-FD]  48.39 25.09 90 top
C9  470nF  [C0805]  32.26 9.34 0 top
C10  470nF  [C0805]  63.88 47.69 0 bottom
C11  470nF  [C0805]  41.16 47.56 0 bottom
C12  47uF  [CAP-TH_BD6.3-P2.5-D0.5]  61.98 38.55 180 top
C14  470nF  [C0805]  9.53 9.47 0 top
C15  47uF  [CAP-TH_BD6.3-P2.5-D0.5]  76.45 38.42 180 top
C16  470nF  [C0805]  70.99 47.69 0 bottom
C17  470nF  [C0805]  56.27 31.18 0 bottom
C18  47uF  [CAP-TH_BD6.3-P2.5-D0.5]  69.6 38.55 180 top
C19  47uF  [CAP-TH_BD6.3-P2.5-D0.5]  54.74 38.55 180 top
C20  470nF  [C0805]  75.18 30.8 0 bottom
CB1  blx-a-b  [FUSE-TH_BLX-A-B]  76.84 94.05 0 top
D1  MUR460  [DO-201_BD5.1-L8.4-P15.24-D1.0-RD]  11.77 89.51 0 top
D2  MUR460  [DO-201_BD5.1-L8.4-P15.24-D1.0-RD]  31.46 96.12 0 top
D3  MUR460  [DO-201_BD5.1-L8.4-P15.24-D1.0-RD]  11.77 96.12 0 top
D4  MUR460  [DO-201_BD5.1-L8.4-P15.24-D1.0-RD]  31.46 89.51 0 top
D5  1N4148  [DO-35_BD2.0-L4.2-P8.20-D0.5-RD]  33.15 54.04 0 top
D7  MUR460  [DO-201_BD5.1-L8.4-P15.24-D1.0-RD]  41.02 39.31 180 top
D9  10A10  [R-6_BD8.9-L8.9-P12.90-D1.4-RD]  4.83 31.82 270 top
D12  MUR460  [DO-201_BD5.1-L8.4-P15.24-D1.0-RD]  56.01 31.18 180 top
D15  MUR460  [DO-201_BD5.1-L8.4-P15.24-D1.0-RD]  75.06 30.93 0 top
D16  1N4148  [DO-35_BD2.0-L4.2-P8.20-D0.5-RD]  22.61 54.04 0 top
D17  1N4148  [DO-35_BD2.0-L4.2-P8.20-D0.5-RD]  76.45 54.04 0 top
D18  1N4148  [DO-35_BD2.0-L4.2-P8.20-D0.5-RD]  65.91 54.04 0 top
D19  1N4148  [DO-35_BD2.0-L4.2-P8.20-D0.5-RD]  54.48 54.04 0 top
D20  1N4148  [DO-35_BD2.0-L4.2-P8.20-D0.5-RD]  43.56 54.04 0 top
D21  1N4007  [DO-41_BD2.4-L4.7-P8.70-D0.8-RD]  62.1 22.8 270 top
H_Q1  15.5*10.5*21  [SINK-TH_L15.0-W10.5-H21.0]  52.74 79.89 0 top
H_Q2  15.5*10.5*21  [SINK-TH_L15.0-W10.5-H21.0]  52.86 64.64 0 top
H_Q3  15.5*10.5*21  [SINK-TH_L15.0-W10.5-H21.0]  73.83 79.86 0 top
H_Q4  15.5*10.5*21  [SINK-TH_L15.0-W10.5-H21.0]  73.7 64.88 0 top
H_Q5  15.5*10.5*21  [SINK-TH_L15.0-W10.5-H21.0]  93.64 79.86 0 top
H_Q6  15.5*10.5*21  [SINK-TH_L15.0-W10.5-H21.0]  93.45 64.89 0 top
J1  KF129-5.08-4P  [CONN-TH_4P-P5.08_KF129-5.08-4P]  93.47 46.3 90 top
JACK-DC1  DC-005-N200  [DC-IN-TH_DC-005-N200]  61.47 8.83 90 top
LED1  D_5MM  [LED-TH_BD5.0-P2.54-L-RD_GREEN]  13.59 53.15 270 top
LED2  D_5MM  [LED-TH_BD5.0-P2.54-L-RD_GREEN]  13.59 60.01 90 top
LED3  D_5MM  [LED-TH_BD5.0-P2.54-L-RD_GREEN]  57.15 17.21 90 top
MINI360  mini5605V3A  [COMM-SMD_MINI5605V5A]  27.94 28.01 0 bottom
Q1  IRF840  [TO-220-3_L10.2-W4.5-P2.54-L-1]  52.66 74.23 0 top
Q2  IRF840  [TO-220-3_L10.2-W4.5-P2.54-L-1]  52.73 58.93 0 top
Q3  IRF840  [TO-220-3_L10.2-W4.5-P2.54-L-1]  73.95 74.15 0 top
Q4  IRF840  [TO-220-3_L10.2-W4.5-P2.54-L-1]  73.7 59.16 0 top
Q5  IRF840  [TO-220-3_L10.2-W4.5-P2.54-L-1]  93.64 74.15 0 top
Q6  IRF840  [TO-220-3_L10.2-W4.5-P2.54-L-1]  93.45 59.17 0 top
R1  10D-15  [RES-TH_L17.5-W6.0-P7.50-D0.8-S7.50]  4.7 77.16 90 top
R2  100K  [RES-TH_L22.0-W10.0-P26.00-D1.0]  4.83 54.17 270 top
R3  3k  [RES-TH_BD2.4-L6.3-P10.30-D0.6]  31.75 59.12 0 top
R4  10Ω  [R1206]  34.81 47.43 0 bottom
R5  10Ω  [R1206]  27.31 47.43 0 bottom
R6  10Ω  [R1206]  48.13 47.56 0 bottom
R7  10Ω  [R1206]  20.33 47.43 0 bottom
R8  10Ω  [R1206]  77.09 47.69 180 bottom
R9  10Ω  [R1206]  56.77 47.56 0 bottom
R10  10Ω  [R1206]  41.7 9.38 180 top
R12  10Ω  [R1206]  66.29 16.58 270 bottom
STM32  STM32 BLUE PILL  [STM32F103C8T6 BLUE PILL]  26.03 9.08 270 top
SW1  KCD1-101  [SW-TH_KCD1-101]  55.25 94.05 0 top
U1  IR2110PBF  [DIP-14_L20.0-W7.6-P2.54-LS7.6-BL]  28.32 47.69 0 top
U2  IR2110PBF  [DIP-14_L20.0-W7.6-P2.54-LS7.6-BL]  49.03 47.69 0 top
U3  IR2110PBF  [DIP-14_L20.0-W7.6-P2.54-LS7.6-BL]  69.6 47.69 0 top

## Footprints (pads in the part's own frame, mm; a bottom-side part is the same pattern mirrored in y, then rotated)
C0805
  rect 1.41x1.35 smd: 1(-1,0) 2(1,0)
CAP-TH_BD4.0-P1.50-D0.8-FD
  round 1.2 hole 0.8: 1(-0.75,0) 2(0.75,0)
CAP-TH_BD6.3-P2.5-D0.5
  round 1.6 hole 0.9: 1(-1.25,0) 2(1.25,0)
CAP-TH_BD6.3-P2.50-D0.5-FD-100UF25V6.3X11KM
  round 1.5 hole 0.9: 1(-1.25,0) 2(1.25,0)
CAP-TH_BD25.0-P10.00-D2.3-FD
  round 3.5 hole 2.3: 1(-5,0) 2(5,0)
CAP-TH_L22.5-W7.5-P20.00-D1.2
  round 2 hole 1.2: 1(-10,0) 2(10,0)
COMM-SMD_MINI5605V5A
  rect 4x6 smd: 1(-13.335,5.7) 2(-13.335,-5.7) 3(13.335,5.7) 4(13.335,-5.7)
CONN-TH_4P-P5.08_KF129-5.08-4P
  round 2.5 hole 1.6: 1(-7.62,0) 2(-2.54,0) 3(2.54,0) 4(7.62,0)
CONN-TH_XY301V-A-5.0-2P
  round 2 hole 1.2: 1(-2.5,0) 2(2.5,0)
DC-IN-TH_DC-005-N200
  oval 3.7x1.7 hole 3x0.8: 2(0.5,-2.4)
  oval 1.8x4.1 hole 1x3.5: 3(-3,2.4) 4(3,2.4)
DIP-14_L20.0-W7.6-P2.54-LS7.6-BL
  rect 1.5x2 hole 1: 1(-7.62,-3.81)
  oval 1.5x2 hole 1: 2(-5.08,-3.81) 3(-2.54,-3.81) 4(0,-3.81) 5(2.54,-3.81) 6(5.08,-3.81) 7(7.62,-3.81) 8(7.62,3.81) 9(5.08,3.81) 10(2.54,3.81) 11(0,3.81) 12(-2.54,3.81) 13(-5.08,3.81) 14(-7.62,3.81)
DO-35_BD2.0-L4.2-P8.20-D0.5-RD
  round 1.6 hole 0.8: 1(-4.1,0) 2(4.1,0)
DO-41_BD2.4-L4.7-P8.70-D0.8-RD
  round 1.8 hole 1.05: 1(-4.35,0) 2(4.35,0)
DO-201_BD5.1-L8.4-P15.24-D1.0-RD
  round 2.8 hole 1.5: 1(-7.62,0) 2(7.62,0)
FUSE-TH_BLX-A-B
  round 2.3 hole 1.5: 1(-11.15,0) 2(11.15,0)
HDR-TH_2P-P2.54-V-M
  rect 2x2 hole 1.2: 1(-1.27,0)
  round 2 hole 1.2: 2(1.27,0)
LED-TH_BD5.0-P2.54-L-RD_GREEN
  round 1.6 hole 1: 1(-1.27,0) 2(1.27,0)
R0805
  rect 1.133x1.377 smd: 1(-1,0) 2(1,0)
R1206
  rect 1.208x1.701 smd: 1(-1.479,0) 2(1.479,0)
R-6_BD8.9-L8.9-P12.90-D1.4-RD
  round 3 hole 2.1: 1(-6.45,0) 2(6.45,0)
RES-TH_BD2.4-L6.3-P10.30-D0.6
  round 1.3 hole 0.8: 1(-5.15,0) 2(5.15,0)
RES-TH_L17.5-W6.0-P7.50-D0.8-S7.50
  round 2 hole 1.2: 1(-3.749,3) 2(3.749,-3)
RES-TH_L22.0-W10.0-P26.00-D1.0
  round 1.7 hole 1.1: 1(-13,0) 2(13,0)
SINK-TH_L15.0-W10.5-H21.0
  round 2 hole 1.5: 1(0,0)
STM32F103C8T6 BLUE PILL
  round 1.651 hole 0.914: 1(-7.62,24.13) 2(-7.62,21.59) 3(-7.62,19.05) 4(-7.62,16.51) 5(-7.62,13.97) 6(-7.62,11.43) 7(-7.62,8.89) 8(-7.62,6.35) 9(-7.62,3.81) 10(-7.62,1.27) 11(-7.62,-1.27) 12(-7.62,-3.81) 13(-7.62,-6.35) 14(-7.62,-8.89) 15(-7.62,-11.43) 16(-7.62,-13.97) 17(-7.62,-16.51) 18(-7.62,-19.05) 19(-7.62,-21.59) 22(7.62,-21.59) 23(7.62,-19.05) 24(7.62,-16.51) 25(7.62,-13.97) 26(7.62,-11.43) 27(7.62,-8.89) 28(7.62,-6.35) 29(7.62,-3.81) 30(7.62,-1.27) 31(7.62,1.27) 32(7.62,3.81) 33(7.62,6.35) 34(7.62,8.89) 35(7.62,11.43) 36(7.62,13.97) 37(7.62,16.51) 38(7.62,19.05) 39(7.62,21.59) 40(7.62,24.13)
  rect 1.651x1.651 hole 0.914: 20(-7.62,-24.13) 21(7.62,-24.13)
SW-TH_KCD1-101
  oval 1.5x6 hole 1x5.5: 1(3.55,0) 2(-3.55,0)
TO-220-3_L10.2-W4.5-P2.54-L-1
  rect 1.8x1.5 hole 1.2x1: 1(-2.54,0)
  oval 1.8x1.5 hole 1.2x1: 2(0,0) 3(2.54,0)

## Nets
As in the schematic.

Pads without a net: H_Q1 1; H_Q2 1; H_Q3 1; H_Q4 1; H_Q5 1; H_Q6 1; STM32 1 9 10 11 12 13 14 15 16 17 21 22 23 24 25 26 27 28 29 30 31 32 33 34 35 36 37; U1 4 8 14; U2 4 8 14; U3 4 8 14

## Via types
v1: diameter 0.61, hole 0.305, Top Layer to Bottom Layer, 75 vias

## Routing (per net, layer and track width the routed paths; a pad name or vN(x,y) marks a point on that pad's centre or on a via; arc(x,y) is an arc through that point)
24V+: length 18.4
  Top Layer w1.5: 24V.1 4.83,32.45 D9.2
+3.3V: length 152.5
  Top Layer w0.254: v1(55.89,49.22) 72.39,49.22 U3.9 ; v1(55.13,50.74) 54.37,51.5 U2.9 52.67,52.95 46.03,52.95 45.34,52.26 45.34,50.99 44.32,49.98 34.93,49.98 U1.9 31.95,52.95 25.45,52.95 24.51,52.01 24.51,50.23 17.4,43.12 17.4,32.2 STM32.20 8,10.61 9.38,10.61 C14.2 11.54,8.45 20.56,8.45 C3.2 22.59,10.48 32.12,10.48 v1(33.26,9.34)
  Bottom Layer w0.254: v1(55.13,50.74) 55.13,49.98 v1(55.89,49.22) ; v1(33.26,9.34) 36.43,6.16 40.03,6.16 44.73,1.46 STM32.38
+5V: length 44.6
  Bottom Layer w0.5: C8.1 46.36,22.31 MINI360.3 37.67,18.7 8.98,18.7 STM32.18
+12V: length 157.8
  Top Layer w0.5: 31.78,39.38 30.78,39.38 v1(27.78,42.38) ; 31.78,39.38 33.33,39.38 D7.2 36.4,42.31 44.92,42.31 U2.3 48.99,41.38 53.15,41.38 C19.1 v1(56.99,37.55) ; 31.78,39.38 v1(31.78,35.88)
  Bottom Layer w0.5: D21.1 61.3,27.15 59.77,28.68 ; D21.1 62.6,27.15 65.6,30.15 65.6,34.15 67.06,35.6 67.06,37.1 ; D21.1 62.1,25.09 12V.1 67.79,19.4 67.79,16.6 R12.2 ; 69.56,37.6 69.06,37.1 67.06,37.1 ; 69.56,37.6 70.5,38.55 C18.1 ; 69.56,37.6 69.56,37.43 C20.2 82.55,30.8 D15.2 ; v1(27.78,42.38) 26.28,43.88 U1.3 25.78,43.27 C4.1 ; 67.06,37.1 U3.3 67.06,45.52 C10.2 ; v1(31.78,35.88) 28.18,35.88 MINI360.1 ; 59.77,28.68 59.77,28.49 C7.1 ; 59.77,28.68 C17.2 56.99,31.46 56.99,32.55 ; 48.4,31.18 49.76,32.55 56.99,32.55 ; 56.99,32.55 v1(56.99,37.55)
GND: length 659.9
  Top Layer w0.254: 58.05,15.74 62.37,11.42 62.37,9.13 ; 58.05,15.74 57.85,15.94 LED3.1 ; 58.05,15.74 58.05,16.21 65.66,23.82 12V.2 v1(66.93,24.83) 65.66,26.1 65.66,35.86 C18.2 ; LED3.1 v1(53.72,15.94) ; LED3.1 53.36,19.73 v1(53.36,21.15) C7.2 v1(52.09,24.58) ; v1(21.42,48.96) 22.43,49.98 22.43,51.5 ; 43.98,43.88 44.74,43.88 46.25,45.39 46.76,45.39 47.52,44.63 47.52,43.62 49.05,42.09 v1(51.08,42.09) ; 43.98,43.88 U2.2 ; 43.98,43.88 42.96,44.9 42.96,47.95 43.73,48.71 v1(44.72,48.71) ; 75.44,59.12 76.2,59.12 Q4.3 ; 75.44,59.12 74.42,58.11 71.63,58.11 v1(65.79,52.26) ; 75.44,59.12 75.44,68.48 0805_R6.2 ; 54.37,58.87 53.35,57.85 49.8,57.85 v1(47.51,55.57) ; 54.37,58.87 54.37,61.66 53.61,62.43 53.61,63.19 ; 54.37,58.87 55.22,58.87 Q2.3 ; v1(68.33,9.33) JACK-DC1.2 63.67,9.13 62.37,9.13 ; C18.2 66.57,38.55 v1(66.31,38.8) ; C18.2 72.16,42.36 81.91,42.36 86.23,46.68 ; 22.43,51.5 U1.13 ; 22.43,51.5 20.95,52.98 20.7,52.98 19.94,53.74 19.94,54 21.97,56.03 25.02,56.03 27.56,58.57 27.56,59.58 24.77,62.38 v1(15.49,62.38) 15.49,56.33 LED1.1 ; 0805_R8.2 95.99,68.55 Q6.3 93.47,56.65 J1.4 86.23,46.68 ; 46.61,31.68 v1(45.85,32.44) ; 46.61,31.68 46.61,32.19 v1(47.12,32.69) ; 46.61,31.68 46.61,27.61 ; 41.02,8.07 41.87,8.07 R10.1 46.94,9.38 v1(46.99,9.34) ; 41.02,8.07 STM32.39 STM32.40 ; 41.02,8.07 39.64,8.07 38.37,9.34 34.31,9.34 ; v1(23.62,35.88) 23.62,43.5 U1.2 ; 86.23,46.68 v1(86.23,27.12) ; 53.61,63.19 53.61,63.44 54.37,64.2 54.37,68.87 0805_R4.1 ; 53.61,63.19 51.32,63.19 v1(50.91,63.6) ; C3.1 21.1,10.99 33.42,10.99 34.31,10.1 34.31,9.34 ; C3.1 v1(19.57,13.53) ; C3.1 19.45,9.59 12.32,9.59 5.21,16.7 STM32.19 v1(7.37,13.78) ; v1(19.05,35.37) 18.94,35.48 C4.2 19.05,39.04 v1(19.05,41.72) ; 46.61,27.61 46.47,27.75 v1(44.32,27.75) ; 46.61,27.61 C8.2 48.4,25.85 v1(50.06,25.85) ; STM32.40 54.7,1.46 JACK-DC1.3 62.37,9.13 ; STM32.40 52.45,3.75 v1(52.45,4.77) ; 34.31,9.34 34.31,8.58 34.05,8.32 32.27,8.32 C9.1 31.26,5.93 v1(31.12,5.78) ; 24V.2 v1(16.51,42.99) ; U3.2 64.52,43.37 v1(63.12,41.98) ; v1(8.53,6.16) C14.1 7.38,10.61 v1(7.13,10.61) ; 39.08,89.34 50.76,89.34 52.79,91.37 52.79,96.71 52.03,97.47 40.43,97.47 D2.2 ; 39.08,89.34 37.72,87.98 37.72,82.4 v1(38.99,81.13) ; 39.08,89.34 D4.2 ; U3.13 64.52,57.6 v1(64.39,57.72) ; C1.2 v1(34.42,68.98)
  Bottom Layer w0.254: v1(51.08,42.09) 51.08,36.86 51.18,36.76 ; v1(67.44,5.66) 67.26,5.83 JACK-DC1.3 ; MINI360.2 14.35,33.96 14.35,41.47 24V.2 ; MINI360.2 14.61,31.69 4.44,21.53 STM32.19 4.44,13.29 v1(7.13,10.61) ; MINI360.2 v1(19.94,33.71) ; v1(35.94,33.72) 35.96,33.71 MINI360.4 42.54,32.44 v1(45.85,32.44) ; STM32.39 47.62,5.4 v1(47.5,5.53) ; 33.91,68.93 33.91,76.05 v1(38.99,81.13) ; 33.91,68.93 C2.1 ; 33.91,68.93 22.14,68.93 C1.2 v1(15.49,62.38) ; 12V.2 69.72,23.82 v1(69.85,23.94) ; C2.1 v1(39.24,73.35) ; C2.1 v1(50.91,63.6) ; 51.18,36.76 v1(47.12,32.69) ; 51.18,36.76 52.97,38.55 C19.2 ; v1(65.79,52.26) 65.02,51.5 U3.13 64.52,49.33 C10.1 64.52,46.06 U3.2 66.31,42.08 v1(66.31,38.8) ; v1(21.08,40.83) 23.24,42.99 23.24,43.23 ; v1(77.22,26.1) 85.22,26.1 v1(86.23,27.12) ; 23.24,43.23 U1.2 20.91,46.22 20.91,48.45 v1(21.42,48.96) ; 23.24,43.23 C4.2 ; v1(47.51,55.57) 47.26,55.57 43.95,52.27 U2.13 44.72,50.74 v1(44.72,48.71) ; v1(45.09,41.34) 43.95,42.47 U2.2 ; 50.82,25.85 v1(50.06,25.85) ; 50.82,25.85 v1(52.09,24.58) ; 50.82,25.85 50.82,26.73 C17.1 52.45,31.18 v1(52.32,31.06) ; C20.1 68.22,24.83 v1(66.93,24.83) ; Q4.3 76.24,58.27 v1(74.42,56.45)
G1: length 49.6
  Top Layer w0.5: 0805_R3.1 50.12,83.11 Q1.1 50.12,70.73 37.25,57.85 D5.2 v1(36.25,53.04)
  Bottom Layer w0.5: R5.2 32.25,50.89 32.25,52.54 33.75,54.04 35.25,54.04 v1(36.25,53.04)
G2: length 47.3
  Top Layer w0.5: 40.78,52.93 v1(38.78,50.93) ; 40.78,52.93 40.78,54.54 39.78,55.54 v1(38.28,55.54) ; 40.78,52.93 41.19,52.93 47.19,58.93 Q2.1 50.19,68.28 0805_R4.2
  Bottom Layer w0.5: 36.28,47.43 38.78,49.93 v1(38.78,50.93) ; v1(38.28,55.54) 28.21,55.54 D16.2
G3: length 78.9
  Top Layer w0.5: v1(48.58,55.54) 50.58,55.54 52.08,54.04 D19.2 58.58,61.32 Q3.1 71.41,81.92 0805_R5.1
  Bottom Layer w0.5: R7.2 24.41,50.04 24.41,53.54 27.41,56.54 47.58,56.54 v1(48.58,55.54)
G4: length 47
  Top Layer w0.5: Q4.1 71.16,67.38 0805_R6.1
  Bottom Layer w0.5: Q4.1 68.16,56.16 50.66,56.16 48.66,54.16 47.78,54.16 ; 47.78,54.16 D20.2 ; 47.78,54.16 46.78,54.16 45.28,52.66 45.28,50.66 46.78,49.16 48.02,49.16 R6.2
G5: length 50.1
  Top Layer w0.5: D17.2 80.45,54.15 v1(76.6,54.15) 76.1,54.65 76.1,55.65 91.1,70.65 Q5.1 91.1,82.64 0805_R7.1
  Bottom Layer w0.5: R8.2 78.6,50.68 78.6,52.15 v1(76.6,54.15)
G6: length 52.5
  Top Layer w0.5: v1(69.01,53.04) D18.2 71.51,55.54 73.04,55.54 75.41,53.17 79.41,53.17 79.91,52.67 84.41,52.67 Q6.1 90.91,68.71 0805_R8.1
  Bottom Layer w0.5: v1(69.01,53.04) 64.01,53.04 63.22,52.25 63.22,50.54 60.25,47.56 R9.2
HIN1: length 41.7
  Top Layer w0.254: STM32.5 27.27,29.44 27.27,41.89 27.05,42.1 27.05,46.93 v1(29.59,49.47)
  Bottom Layer w0.254: v1(29.59,49.47) 30.86,50.74 U1.10
HIN2: length 63.7
  Top Layer w0.254: v1(52.45,40.33) 49.66,37.53 47.88,37.53 44.83,40.58 36.45,40.58 35.94,40.07 35.94,39.06 41.28,33.72 41.28,16.2 40.51,15.43 38.74,15.43 STM32.6
  Bottom Layer w0.254: U2.10 51.57,48.32 55.25,44.64 55.25,43.12 v1(52.45,40.33)
HIN3: length 57.3
  Top Layer w0.254: v1(68.71,46.17) 68.45,45.91 68.45,41.85 43.81,17.21 43.81,16.2 42.54,14.93 36.7,14.93 STM32.7
  Bottom Layer w0.254: v1(68.71,46.17) 68.71,48.2 72.01,51.5 U3.10
LIN1: length 57.4
  Top Layer w0.254: U1.12 25.78,48.2 21.97,44.39 21.97,43.37 22.85,42.49 22.85,28.02 33.66,17.21 33.66,16.2 35.43,14.42 45.34,14.42 STM32.2
LIN2: length 41.7
  Bottom Layer w0.254: U2.12 47.88,50.12 49.03,50.12 50.56,48.59 50.56,45.8 50.33,45.57 50.33,38.46 46.49,34.62 46.49,29.03 49.29,26.24 49.29,20.91 STM32.3
LIN3: length 45
  Top Layer w0.254: STM32.4 62.1,36.26 62.1,39.06 65.91,42.87 65.91,45.66 v1(66.93,46.68)
  Bottom Layer w0.254: U3.12 66.93,51.38 v1(66.93,46.68)
SD: length 95.8
  Top Layer w0.254: U3.11 68.07,49.98 50.56,49.98 U2.11 47,49.47 30.61,49.47 29.34,50.74 28.32,50.74 ; R10.2 39.71,9.38 STM32.8 ; 28.32,50.74 U1.11 ; 28.32,50.74 28.32,49.47 24.51,45.66 24.51,27.37 v1(33.91,17.97)
  Bottom Layer w0.254: v1(33.91,17.97) 32.64,16.7 STM32.8
U: length 193.1
  Top Layer w1.133: 0805_R3.2 55.2,83.1 Q1.3
  Bottom Layer w1.35: C5.1 36.33,35.75 33.53,35.75 32.13,37.14 26.53,37.14 ; 26.53,37.14 18.13,37.14 15.33,39.94 15.33,57.76 20.93,63.36 34.93,63.36 37.73,60.56 52.73,60.56 ; 26.53,37.14 26.53,38.45 C6.2
  Bottom Layer w1.5: C6.2 30.86,43.73 U1.5 ; 55.2,63.38 55.2,63.03
  Bottom Layer w2.8: J1.3 87.38,54.93 87.38,70.55 73.28,84.65 65.28,84.65 55.2,74.57 Q1.3 58,71.43 58,66.17 55.2,63.38 52.82,60.99 52.82,59.01 Q2.2
V: length 139.5
  Top Layer w1.133: 0805_R5.2 76.49,81.83 Q3.3
  Top Layer w1.35: 59.7,39.56 59.7,36.76 56.9,33.96 42.56,33.96 v1(36.96,39.56)
  Top Layer w1.5: 59.7,45.16 59.7,39.56 C12.2 ; 59.7,45.16 62.5,47.96 79.3,47.96 v1(82.1,50.76) ; 59.7,45.16 56.9,47.96 54.1,47.96 51.57,45.44 U2.5
  Bottom Layer w1.35: v1(36.96,39.56) 39.76,42.36 39.76,47.16 C11.1
  Bottom Layer w1.5: 82.91,51.57 v1(82.1,50.76)
  Bottom Layer w2.8: 76.28,63.78 73.79,61.28 73.79,59.25 Q4.2 ; 76.28,63.78 76.28,62.52 82.91,55.9 82.91,48.86 88.01,43.75 J1.2 ; 76.28,63.78 76.49,63.99 Q3.3
W: length 83.5
  Top Layer w1.133: 0805_R7.2 96.18,83.32 Q5.3
  Bottom Layer w1.35: C16.1 69.99,46.03 U3.5
  Bottom Layer w1.5: U3.5 72.14,41.49 C15.2
  Bottom Layer w1.577: J1.1 90.67,35.88 77.75,35.88 C15.2
  Bottom Layer w2.8: J1.1 97.3,42.5 97.3,54.05 93.47,57.88 93.47,59.15 Q6.2 93.54,59.26 93.54,60.59 97.3,64.35 97.3,73.03 Q5.3
$1N1189: length 19.7
  Top Layer w1.95: D1.2 16.31,89.51 R1.2
  Bottom Layer w2.776: D1.2 D4.1
$1N1193: length 145.5
  Top Layer w1.5: v1(72.26,71.43) 83.46,71.43 v1(88.98,76.95) ; v1(52.66,71.43) v1(66.66,71.43)
  Bottom Layer w1.5: C2.2 44.84,83.6 52.66,75.78 Q1.2 v1(52.66,71.43) ; v1(66.66,71.43) v1(72.26,71.43) 73.95,73.12 Q3.2 ; v1(88.98,76.95) 91.78,76.95 93.64,75.09 Q5.2
  Bottom Layer w1.577: LED2.1 5.16,67.17 R2.1
  Bottom Layer w1.675: 14.69,78.98 14.69,77.03 R2.1
  Bottom Layer w1.95: C1.1 34.62,78.98 C2.2
  Bottom Layer w2.776: C1.1 14.69,78.98 D1.1 D3.1
$1N1203: length 80.5
  Bottom Layer w1.95: 220AC_20khz.2 92.83,88.75 50.83,88.75 46.26,93.32 26.64,93.32 D2.1
  Bottom Layer w2.776: D2.1 D3.2
$1N1451: length 8.7
  Top Layer w1.95: CB1.2 90.49,96.55 220AC_20khz.1
$1N1570: length 6.9
  Bottom Layer w1.5: CB1.1 SW1.1
$1N1572: length 58.5
  Top Layer w1.5: SW1.2 50.66,93.01 32.28,93.01 12.68,73.41 R1.1
$1N2568: length 14.3
  Bottom Layer w1.577: LED1.2 4.83,43.12 R2.2
$1N4239: length 20.2
  Bottom Layer w0.5: D5.1 29.55,53.54 29.55,50.65 26.33,47.43 R5.1 27.39,45.88 33.94,45.88 U1.7
$1N4372: length 36.1
  Top Layer w0.5: v1(34.2,52.88) 31.7,55.38 22.2,55.38 v1(20.7,53.88)
  Bottom Layer w0.5: R4.1 34.7,48.81 34.7,52.38 v1(34.2,52.88) ; v1(20.7,53.88) 20.2,53.38 18.2,53.38 ; 18.2,53.38 18.2,53.74 D16.1 ; 18.2,53.38 18.2,51.38 17.7,50.88 17.7,46.38 20.2,43.88 U1.1
$1N7045: length 27.1
  Bottom Layer w0.254: U1.6 32.89,43.37 ; 32.89,43.37 28.56,39.04 C6.1 ; 32.89,43.37 35.94,40.33 35.94,39.06 36.45,38.55 37.34,38.55 39.75,40.96 41.51,40.96 C5.2 48.01,39.94 D7.1
$1N7570: length 54.5
  Top Layer w0.5: v1(49.54,56.38) 51.04,56.38 v1(52.04,55.38) ; U2.7 56.65,44.11 v1(54.88,45.88)
  Bottom Layer w0.5: 18.85,47.43 22.04,50.63 22.04,52.38 27.04,57.38 48.54,57.38 v1(49.54,56.38) ; 50.54,53.88 51.04,53.38 51.88,53.38 52.88,52.38 52.88,47.88 v1(54.88,45.88) ; 50.54,53.88 D19.1 ; 50.54,53.88 v1(52.04,55.38)
$1N7573: length 16.6
  Bottom Layer w0.5: D20.1 39.46,51.34 40.91,49.88 42.41,49.88 44.91,47.38 ; 44.91,47.38 46.47,47.38 R6.1 ; 44.91,47.38 U2.1
$1N7591: length 38.6
  Top Layer w0.5: v1(51.16,46.84) 50.44,47.56 v1(43.66,47.56)
  Bottom Layer w0.5: C11.2 v1(43.66,47.56) ; v1(51.16,46.84) U2.6 51.61,41.38 51.61,39.88 52.11,39.38 52.61,39.38 53.11,39.88 61.89,39.88 C12.1 63.23,31.59 D12.1
$1N8447: length 15.4
  Bottom Layer w0.254: 77.3,46.42 77.3,43.96 U3.7 ; 77.3,46.42 75.01,46.42 73.23,48.2 73.23,53.16 D17.1 ; 77.3,46.42 R8.1
$1N8450: length 17.4
  Bottom Layer w0.5: U3.1 58.97,43.88 R9.1 55.34,47.56 61.81,54.04
$1N8468: length 25
  Top Layer w0.5: D15.1 70.21,30.93 C15.1
  Bottom Layer w0.5: C15.1 77.7,40.85 U3.6 74.68,45.01 C16.2
$1N24434: length 7.9
  Bottom Layer w0.5: D21.2 59.07,15.41 JACK-DC1.4
$1N24781: length 33.2
  Top Layer w1.256: R3.1 24.43,56.95 18.83,56.95 16.03,54.15 16.03,50.06 4.83,38.86 D9.1
$1N24783: length 26.5
  Top Layer w1.256: v1(19.19,64.08) 31.94,64.08 R3.2
  Bottom Layer w1.256: LED2.2 16.39,61.28 v1(19.19,64.08)
$1N34091: length 10.4
  Bottom Layer w0.254: LED3.2 58.42,19.75 64.6,19.75 R12.1

## Copper pours and planes (outline as drawn; the poured copper is in the pictures)
GND on Top Layer: 67.18,31.18 101.09,31.18 101.09,-2.85 67.18,-2.85
GND on Top Layer: 78.9,57.41 108.59,57.41 108.59,31.06 78.9,31.06
GND on Top Layer: -5.46,57.34 79.12,57.34 79.12,-2.73 -5.46,-2.73
GND on Top Layer: -5.97,101.16 107.57,101.16 107.57,57.22 -5.97,57.22
GND on Bottom Layer: 78.9,57.21 108.59,57.21 108.59,31.06 78.9,31.06
GND on Bottom Layer: -4.44,99.13 109.85,99.13 109.85,57.47 -4.44,57.47
GND on Bottom Layer: 79.12,32.2 100.2,32.2 100.2,-1.24 79.12,-1.24
GND on Bottom Layer: -1.91,57.22 79.12,57.22 79.12,-1.46 -1.91,-1.46

## Text on the board
Bottom Solder Mask Layer: NGUYEN VUONG TRIEU | 42200368
Top Silkscreen Layer: + | -
